# EAGLE design 4 CV buffer design element (EAGLE 9.6.2)
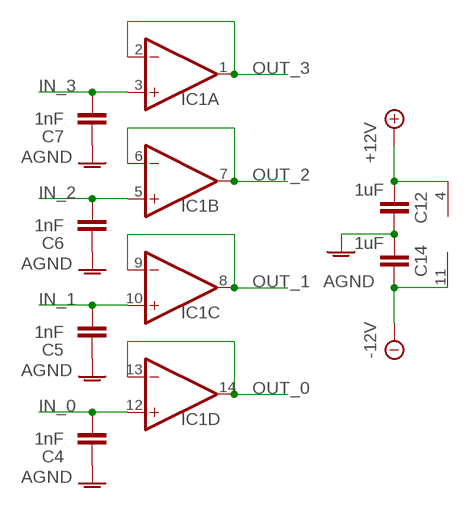
[diagram p0: schematic, sheet 1]

## Parts
C4  1nF  C-EU-J0603  [C0603-J]
C5  1nF  C-EU-J0603  [C0603-J]
C6  1nF  C-EU-J0603  [C0603-J]
C7  1nF  C-EU-J0603  [C0603-J]
C12  1uF  C-EU-J0402  [C0402-J]
C14  1uF  C-EU-J0402  [C0402-J]
IC1  TL074JT  [TSSOP14J]

## Nets
+12V: C12.1 IC1.4(P:V+)
-12V: C14.2 IC1.11(P:V-)
AGND: C4.1 C5.1 C6.1 C7.1 C12.2 C14.1
IN_0: C4.2 IC1.12(D:+IN)
IN_1: C5.2 IC1.10(C:+IN)
IN_2: C6.2 IC1.5(B:+IN)
IN_3: C7.2 IC1.3(A:+IN)
OUT_0: IC1.13(D:-IN) IC1.14(D:OUT)
OUT_1: IC1.8(C:OUT) IC1.9(C:-IN)
OUT_2: IC1.6(B:-IN) IC1.7(B:OUT)
OUT_3: IC1.1(A:OUT) IC1.2(A:-IN)

## Library data of the parts
C4-C7 C12 C14 = joakim:C-EU-J: CAPACITOR, European symbol
IC1 = joakim:TL074J: OP AMP

## Board
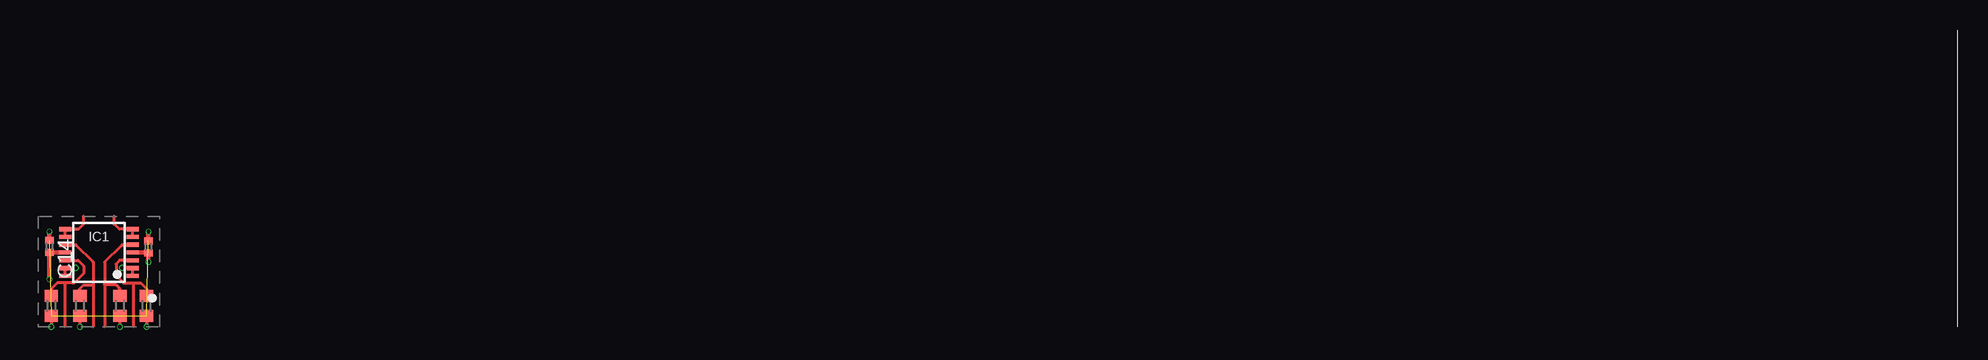
[diagram p1: board, top side]
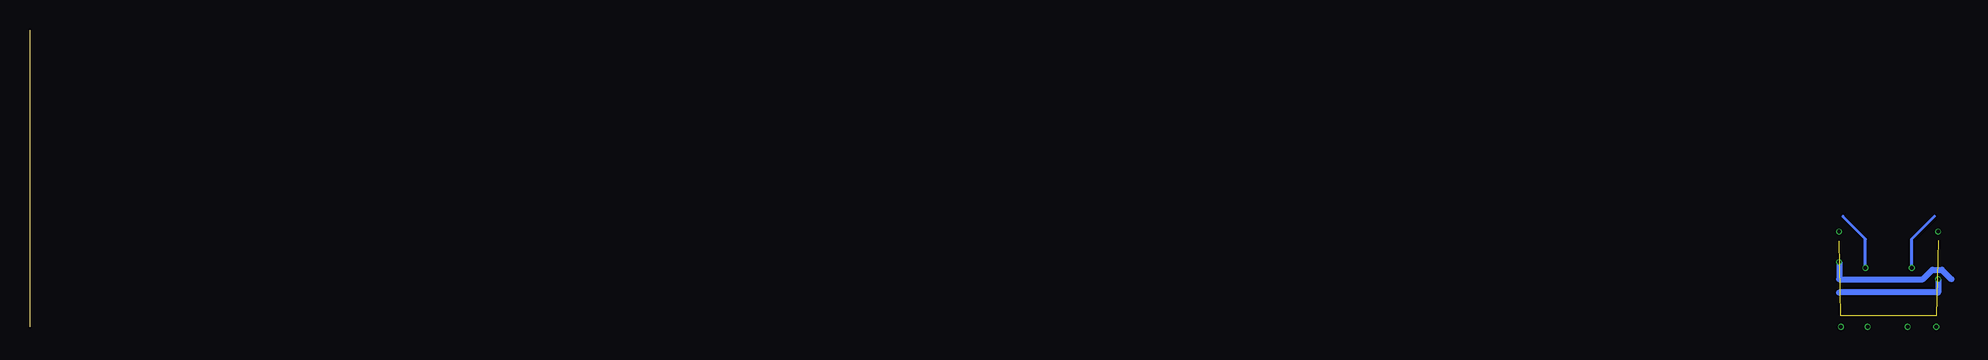
[diagram p2: board, bottom side, seen from below]

Size 0 x 24.77 mm. Coordinates in mm from the lower left corner, seen from the top.
Outline: 0,0 0,21.91 0,24.77
Copper layers (1*16): Top 0.035mm / dielectric 1.6mm / Bottom 0.035mm
Design rules "jlcpcb-2layers": minimum track width 5mil, minimum drill 0.3mm, track to track 5mil, track to pad 5mil, pad to pad 5mil, via to via 5mil, smd to smd 5mil, copper to edge 0.2mm, drill to drill 6mil, minimum pad ring 10mil, minimum via ring 3mil, stop-mask expansion 4mil, vias tented up to drill 0mil, thermal gap 10mil

### Footprints (pad centres in the part's own frame; a part is rotated, then mirrored left to right if it is on the bottom)
C0603-J = smd 1 x 1.1: 1 -0.85,0; 2 0.85,0
C0402-J = smd 0.6 x 0.7: 1 -0.5,0; 2 0.5,0
TSSOP14J = smd 0.35 x 1: 1 -1.95,-2.825; 2 -1.3,-2.825; 3 -0.65,-2.825; 4 0,-2.825; 5 0.65,-2.825; 6 1.3,-2.825; 7 1.95,-2.825; 8 1.95,2.825; 9 1.3,2.825; 10 0.65,2.825; 11 0,2.825; 12 -0.65,2.825; 13 -1.3,2.825; 14 -1.95,2.825

### Placement (x,y rotation side)
C4  -158.89,1.75 90 top  (outside the outline)
C5  -156.51,1.75 90 top  (outside the outline)
C6  -153.17,1.75 90 top  (outside the outline)
C7  -150.95,1.75 90 top  (outside the outline)
C12  -150.79,6.67 90 top  (outside the outline)
C14  -159.05,6.69 270 top  (outside the outline)
IC1  -154.92,6.19 90 top  (outside the outline)

### Tracks (layer width: path | path; a pad name or v marks a point on that pad's centre or on a via)
+12V  (via drill 0.33)
  Top 0.356: IC1.4 -150.82,6.19 C12.1 v-150.79,5.4
  Bottom 0.508: v-150.79,5.4 -150.79,3.97 -157.78,3.97 -158.57,4.76 -159.37,4.76 -160.16,3.97
-12V  (via drill 0.33)
  Top 0.356: IC1.11 C14.2 v-159.05,3.97
  Bottom 0.508: v-159.05,3.97 -159.05,2.86 -150.79,2.86
AGND  (via drill 0.33)  (5 unrouted)
  Top 0.254: C4.1 v-158.89,0 | C5.1 v-156.51,0 | C6.1 v-153.17,0 | C7.1 v-150.95,0
  Top 0.356: C14.1 v-159.05,7.94 | C12.2 v-150.79,7.94
IN_0
  Top 0.254: IC1.12 -156.65,5.54 -156.19,5.08 -156.19,4.45 -156.98,3.65 -157.14,3.65 -157.78,3.65 | C4.2 -158.89,3.17 -158.41,3.65 -157.78,3.65 | -157.78,3.65 -157.78,0
IN_1
  Top 0.254: IC1.10 -156.84,6.84 -155.4,5.4 -155.4,3.49 | -155.4,3.49 -155.4,0 | C5.2 -156.51,3.17 -156.19,3.49 -155.4,3.49
IN_2
  Top 0.254: -154.44,3.65 -154.44,5.4 -153,6.84 IC1.5 | -154.44,3.65 -154.44,3.55 | -154.44,3.65 -154.44,3.49 | -154.44,3.49 -154.44,0 | C6.2 -153.17,3.17 -153.49,3.49 -154.44,3.49
IN_3
  Top 0.254: C7.2 -150.95,3.17 -151.43,3.65 -152.06,3.65 | IC1.3 -153.19,5.54 -153.49,5.24 -153.49,4.29 -152.86,3.65 -152.06,3.65 | -152.06,3.65 -152.06,0
OUT_0  (via drill 0.33)
  Top 0.254: IC1.13 IC1.14 -157.75,4.88 -157.7,4.92 v-156.84,4.92
  Bottom 0.254: v-156.84,4.92 -156.84,7.32 -158.73,9.21
OUT_1
  Top 0.254: IC1.9 IC1.8 -156.62,8.14 -156.19,8.57 -156.19,9.21
OUT_2
  Top 0.254: IC1.6 IC1.7 -153.22,8.14 -153.65,8.57 -153.65,9.21
OUT_3  (via drill 0.33)
  Top 0.254: IC1.2 IC1.1 -152.09,4.88 -152.14,4.92 v-153,4.92
  Bottom 0.254: v-153,4.92 -153,7.32 -151.11,9.21